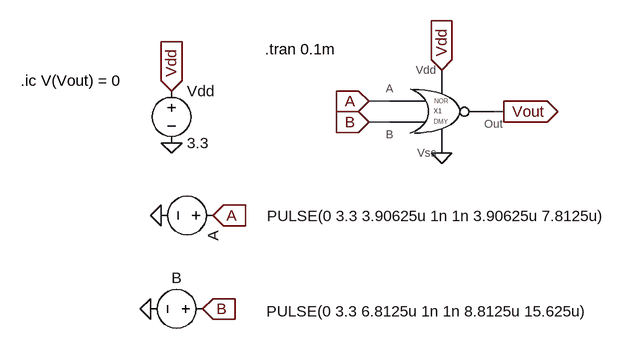
[diagram p0: schematic NOR_test.asc]
NOR_test.asc, the LTspice schematic file:
Version 4
SHEET 1 880 920
WIRE 144 128 112 128
WIRE 320 144 304 144
WIRE 144 160 112 160
FLAG 224 208 0
FLAG -192 192 0
FLAG -208 304 0
FLAG -128 304 A
IOPIN -128 304 In
FLAG 112 160 B
IOPIN 112 160 In
FLAG 112 128 A
IOPIN 112 128 In
FLAG -144 448 B
IOPIN -144 448 In
FLAG -192 112 Vdd
IOPIN -192 112 In
FLAG 224 80 Vdd
IOPIN 224 80 In
FLAG 320 144 Vout
IOPIN 320 144 Out
FLAG -224 448 0
SYMBOL NOR 224 144 R0
SYMATTR InstName X1
SYMBOL voltage -192 96 R0
WINDOW 123 0 0 Left 0
WINDOW 39 0 0 Left 0
SYMATTR InstName Vdd
SYMATTR Value 3.3
SYMBOL voltage -112 304 R90
WINDOW 3 1 -594 VRight 2
WINDOW 123 0 0 Left 0
WINDOW 39 0 0 Left 0
SYMATTR Value PULSE(0 3.3 3.90625u 1n 1n 3.90625u 7.8125u)
SYMATTR InstName A
SYMBOL voltage -128 448 R90
WINDOW 0 -32 56 VBottom 2
WINDOW 3 -12 -332 VTop 2
WINDOW 123 0 0 Left 0
WINDOW 39 0 0 Left 0
SYMATTR InstName B
SYMATTR Value PULSE(0 3.3 6.8125u 1n 1n 8.8125u 15.625u)
TEXT -48 48 Left 2 !.tran 0.1m
TEXT -424 96 Left 2 !.ic V(Vout) = 0

The netlist it stands for:
* NOR_test.asc
XX1 A B Vdd 0 Vout NOR  ; pins A B Vdd Vss Out
Vdd Vdd 0 3.3
V§A A 0 PULSE(0 3.3 3.90625u 1n 1n 3.90625u 7.8125u)
V§B B 0 PULSE(0 3.3 6.8125u 1n 1n 8.8125u 15.625u)
.tran 0.1m
.ic V(Vout) = 0
.backanno
.end

* Results of the author's LTspice run, read from the files saved beside the schematic
* Operating Point, zero values left out:
*   V(vdd) = 3.3 V
*   I(Vdd) = -29.24 mA
*   Ix(x1:VDD) = 29.24 mA
*   Ix(x1:OUT) = -29.24 mA
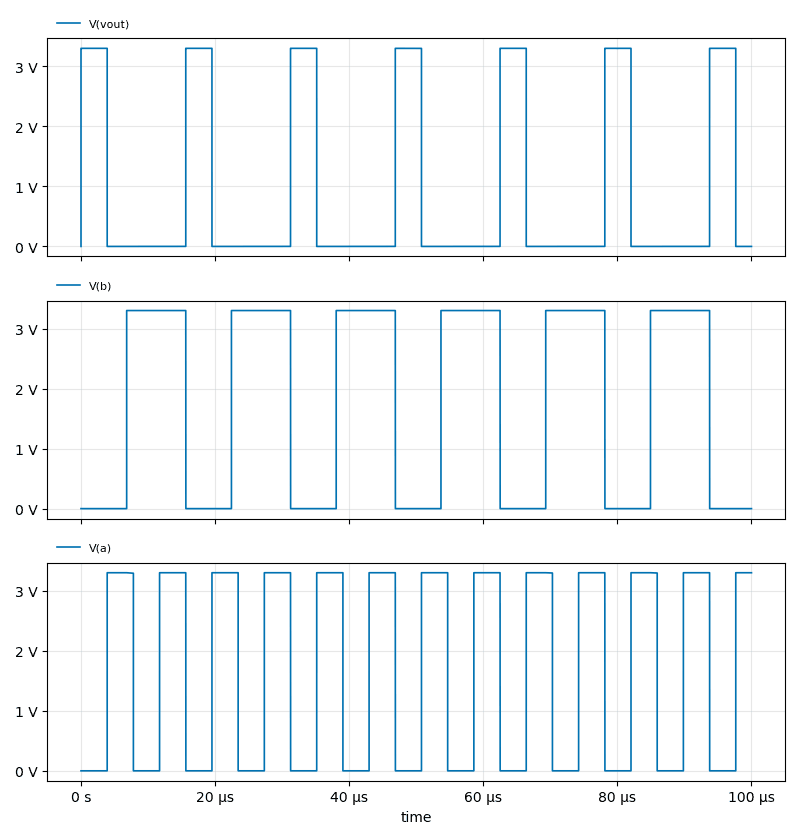
[diagram p1: Transient Analysis of NOR_test.asc, plotted from the saved traces]
* Transient Analysis, 1 run:
*   V(vout): min 0 V, max 3.3 V, average 902.2 mV, rms 1.725 V, last 0 V
*   V(b): min 0 V, max 3.3 V, average 1.745 V, rms 2.4 V, last 0 V
*   V(a): min 0 V, max 3.3 V, average 1.625 V, rms 2.315 V, last 3.3 V